# EAGLE design vis-analog-out (EAGLE 9.6.2)

## Sheet 1 of 2
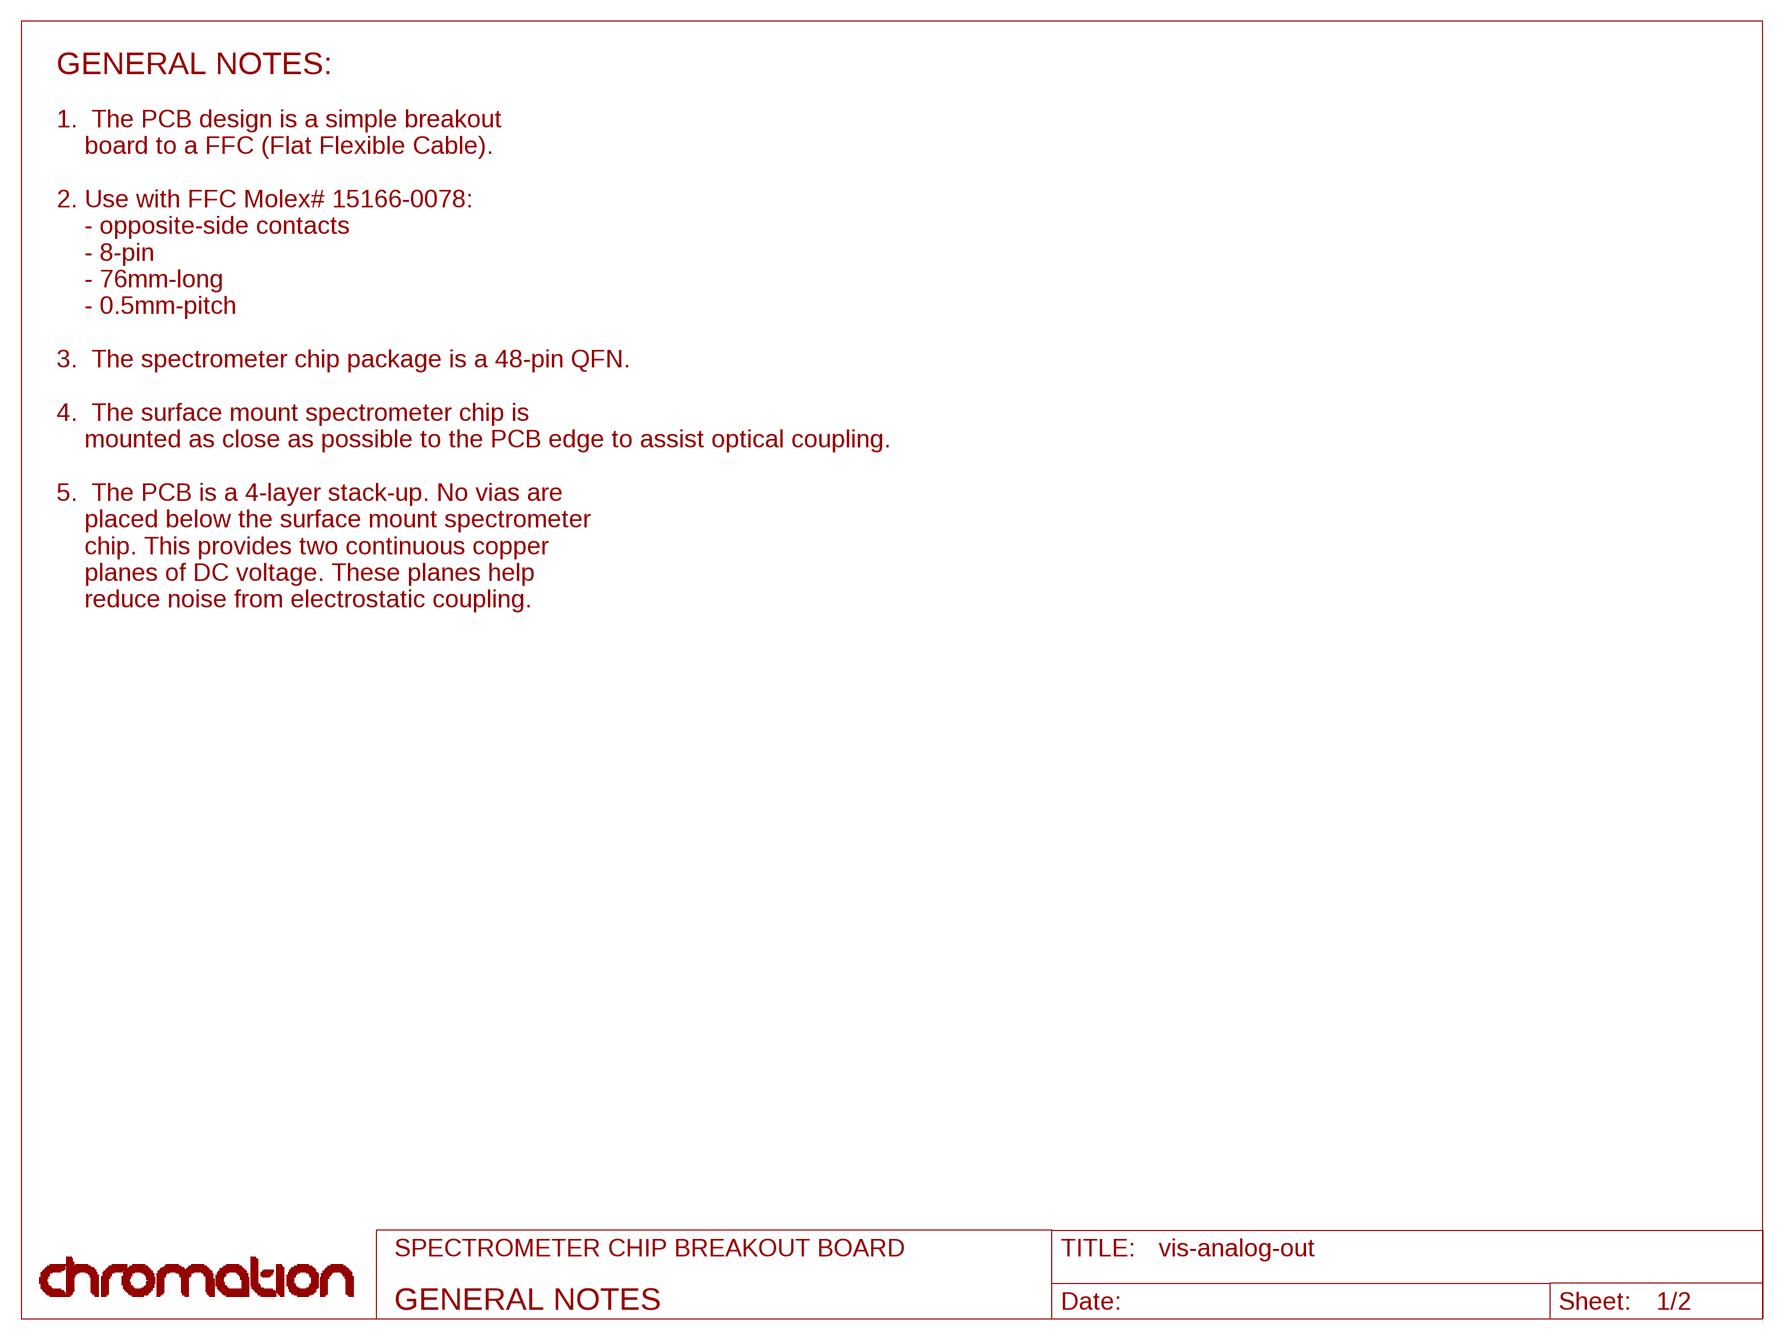
[diagram p0: schematic, sheet 1]

### Notes on the sheet
- GENERAL NOTES:
- 1.  The PCB design is a simple breakout
      board to a FFC (Flat Flexible Cable).
  
  2. Use with FFC Molex# 15166-0078:
      - opposite-side contacts
      - 8-pin
      - 76mm-long
      - 0.5mm-pitch
  
  3.  The spectrometer chip package is a 48-pin QFN.
  
  4.  The surface mount spectrometer chip is
      mounted as close as possible to the PCB edge to assist optical coupling.
  
  5.  The PCB is a 4-layer stack-up. No vias are
      placed below the surface mount spectrometer
      chip. This provides two continuous copper
      planes of DC voltage. These planes help
      reduce noise from electrostatic coupling.
- SPECTROMETER CHIP BREAKOUT BOARD
- GENERAL NOTES

## Sheet 2 of 2
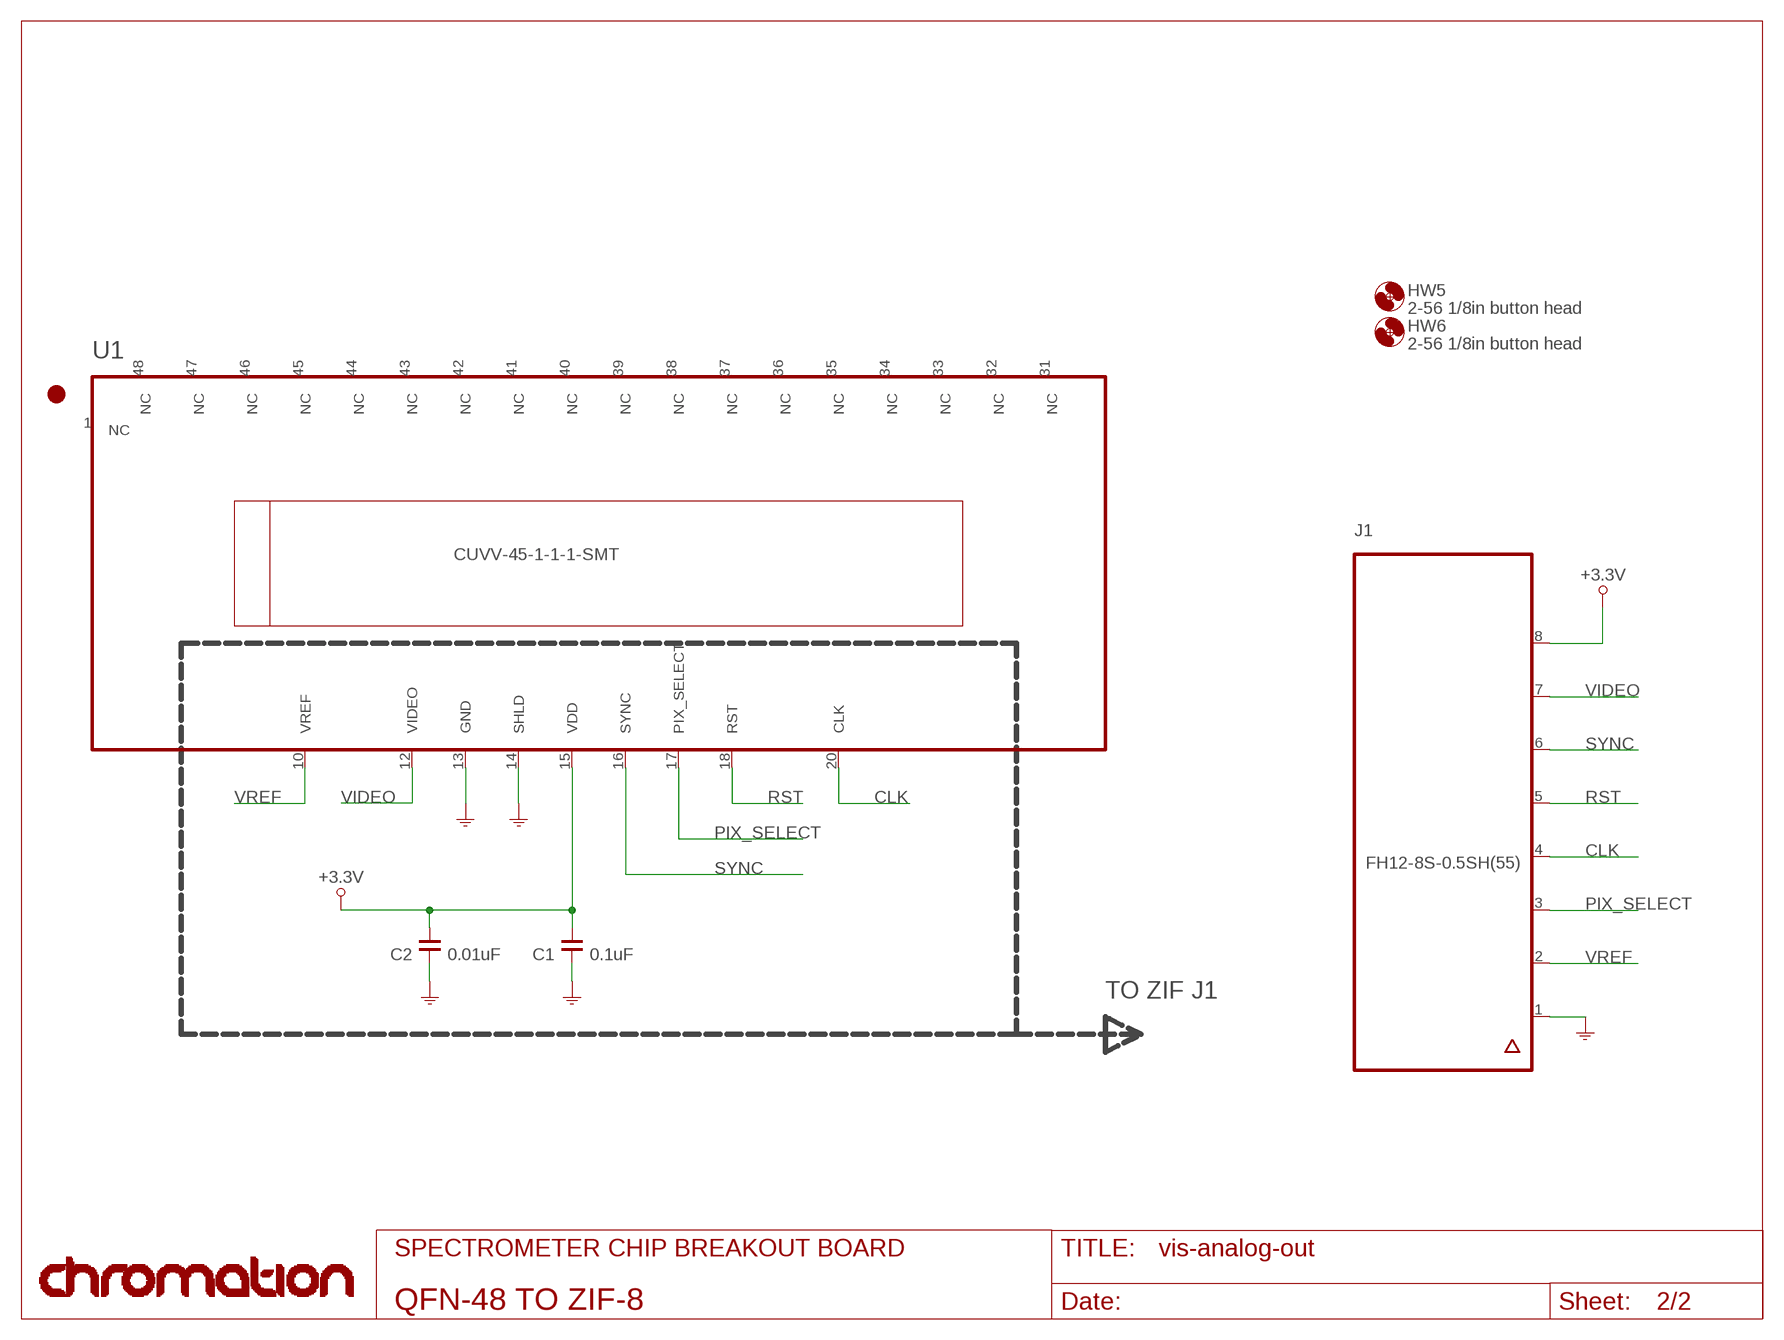
[diagram p1: schematic, sheet 2]

### Parts
C1  0.1uF  C_0603  [0603]
C2  0.01uF  C_0603  [0603]
HW5  2-56 1/8in button head  MOUNTING-HOLE_2-56_SCREW  [MCMASTER_92949A081]
HW6  2-56 1/8in button head  MOUNTING-HOLE_2-56_SCREW  [MCMASTER_92949A081]
J1  FH12-8S-0.5SH(55)  ZIF_8-PIN  [FH12-8S-0.5SH]
U1  CUVV-45-1-1-1-SMT  VIS-QFN48  [VIS-PKG]

### Nets
+3.3V: C1.1 C2.1 J1.8 U1.15(VDD)
CLK: J1.4 U1.20(CLK)
GND: C1.2 C2.2 J1.1 U1.13(GND) U1.14(SHLD)
PIX_SELECT: J1.3 U1.17(PIX_SELECT)
RST: J1.5 U1.18(RST)
SYNC: J1.6 U1.16(SYNC)
VIDEO: J1.7 U1.12(VIDEO)
VREF: J1.2 U1.10(VREF)
Unconnected: J1.LEG@1(LEG) J1.LEG@2(LEG) U1.1(NC) U1.2(NC) U1.3(NC) U1.4(NC) U1.5(NC) U1.6(NC) U1.7(NC) U1.8(NC) U1.9(NC) U1.11(NC) U1.19(NC) U1.21(NC) U1.22(NC) U1.23(NC) U1.24(NC) U1.25(NC) U1.26(NC) U1.27(NC) U1.28(NC) U1.29(NC) U1.30(NC) U1.31(NC) U1.32(NC) U1.33(NC) U1.34(NC) U1.35(NC) U1.36(NC) U1.37(NC) U1.38(NC) U1.39(NC) U1.40(NC) U1.41(NC) U1.42(NC) U1.43(NC) U1.44(NC) U1.45(NC) U1.46(NC) U1.47(NC) U1.48(NC)

### Notes on the sheet
- TO ZIF J1
- SPECTROMETER CHIP BREAKOUT BOARD
- QFN-48 TO ZIF-8

## Library data of the parts
C1 = 0603:C_; EXPORT: YES; MANUF: TDK; MANUF_PNUM: CGA3E2X7R1H104K080AA; VENDOR1: Mouser; VENDOR1_PNUM: 810-CGA3E2X7R1H104K; VENDOR1_PQ_00001: 0.10
C2 = 0603:C_; EXPORT: YES; MANUF: Kemet; MANUF_PNUM: C0603C103K5RACTU; NOTES: --; VENDOR1: Mouser; VENDOR1_PNUM: 80-C0603C103K5R; VENDOR1_PQ_00001: 0.10
HW5 HW6 = Chromation:MOUNTING-HOLE_: McMaster mounting hardware.; EXPORT: YES; MANUF: --; MANUF_PNUM: --; NOTES: 2-56 Screw, 1/8-in Long, Socket Head, Hex Drive; VENDOR1: McMaster; VENDOR1_PNUM: 92949A074; VENDOR1_PQ_00001: 0.0553
J1 = ZIF:ZIF_; EXPORT: YES; MANUF: Hirose Connector; MANUF_PNUM: FH12-8S-0.5SH(55); NOTES: --; VENDOR1: Mouser; VENDOR1_PNUM: 798-FH128S05SH55; VENDOR1_PQ_00001: 1.54
U1 = VIS-PKG:VIS; EXPORT: YES; MANUF: Chromation; MANUF_PNUM: CUVV-45-1-1-1-SMT; NOTES: --; VENDOR1: Chromation; VENDOR1_PNUM: CUVV-45-1-1-1-SMT; VENDOR1_PQ_00001: --

## Board
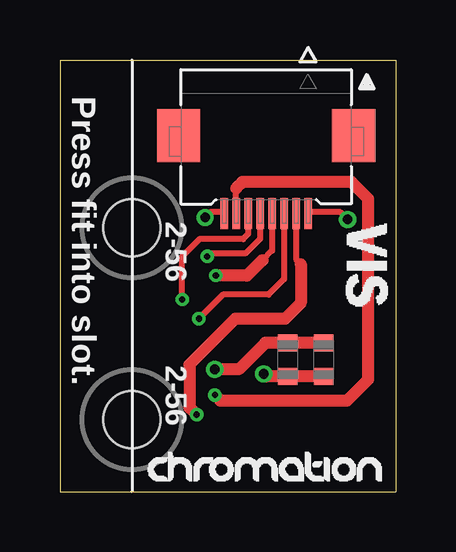
[diagram p2: board, top side]
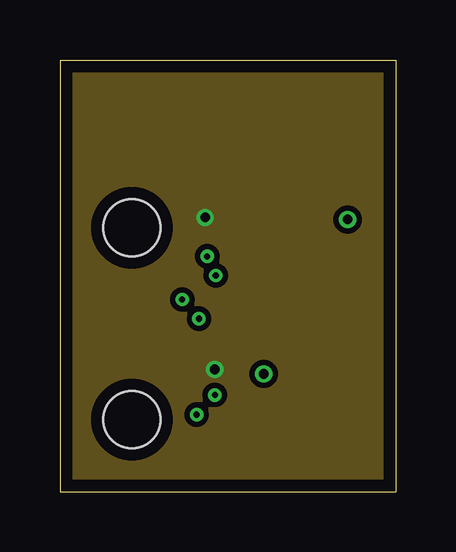
[diagram p3: board, inner layer Route2]
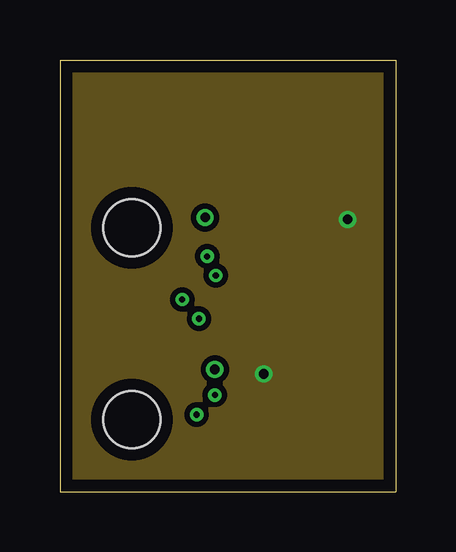
[diagram p4: board, inner layer Route15]
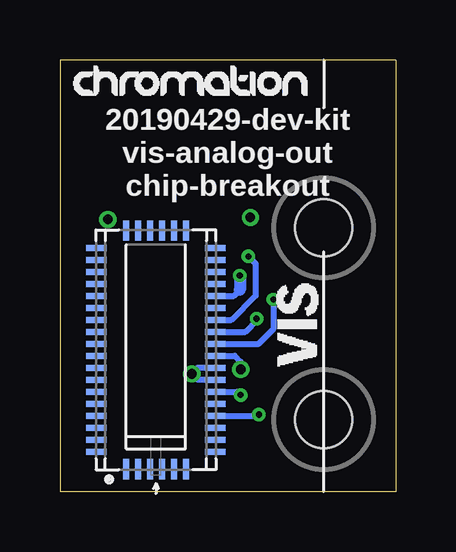
[diagram p5: board, bottom side, seen from below]

Size 14 x 18 mm. Coordinates in mm from the lower left corner, seen from the top.
Outline: 0,0 14,0 14,18 0,18 0,0
Copper layers (1*2*15*16): Top 0.035mm / dielectric 0.23mm / Route2 0.035mm / dielectric 0.93mm / Route15 0.035mm / dielectric 0.23mm / Bottom 0.035mm
Design rules "Conservative-clearance-check-before-4-layers-PCB-NG": minimum track width 5mil, minimum drill 10mil, track to track 9mil, track to pad 8mil, pad to pad 7mil, via to via 10mil, smd to smd 0mil, copper to edge 20mil, drill to drill 8mil, minimum pad ring 8mil, minimum via ring 6mil, stop-mask expansion 4mil, vias tented up to drill 100mil, thermal gap 10mil

### Footprints (pad centres in the part's own frame; a part is rotated, then mirrored left to right if it is on the bottom)
0603 = smd 0.7 x 0.8: 1 -0.7,0; 2 0.7,0
MCMASTER_92949A081 = hole 2.388: 0,0
FH12-8S-0.5SH = smd 0.3 x 1.3: 1 1.75,-3.2; 2 1.25,-3.2; 3 0.75,-3.2; 4 0.25,-3.2; 5 -0.25,-3.2; 6 -0.75,-3.2; 7 -1.25,-3.2; 8 -1.75,-3.2 | smd 1.8 x 2.2: LEG@1 -3.65,0.05; LEG@2 3.65,0.05
VIS-PKG = smd 0.25 x 0.85: 1 -1.25,-4.975; 2 -0.75,-4.975; 3 -0.25,-4.975; 4 0.25,-4.975; 5 0.75,-4.975; 6 1.25,-4.975; 25 1.25,4.975; 26 0.75,4.975; 27 0.25,4.975; 28 -0.25,4.975; 29 -0.75,4.975; 30 -1.25,4.975 | smd 0.85 x 0.25: 7 2.475,-4.25; 8 2.475,-3.75; 9 2.475,-3.25; 10 2.475,-2.75; 11 2.475,-2.25; 12 2.475,-1.75; 13 2.475,-1.25; 14 2.475,-0.75; 15 2.475,-0.25; 16 2.475,0.25; 17 2.475,0.75; 18 2.475,1.25; 19 2.475,1.75; 20 2.475,2.25; 21 2.475,2.75; 22 2.475,3.25; 23 2.475,3.75; 24 2.475,4.25; 31 -2.475,4.25; 32 -2.475,3.75; 33 -2.475,3.25; 34 -2.475,2.75; 35 -2.475,2.25; 36 -2.475,1.75; 37 -2.475,1.25; 38 -2.475,0.75; 39 -2.475,0.25; 40 -2.475,-0.25; 41 -2.475,-0.75; 42 -2.475,-1.25; 43 -2.475,-1.75; 44 -2.475,-2.25; 45 -2.475,-2.75; 46 -2.475,-3.25; 47 -2.475,-3.75; 48 -2.475,-4.25

### Placement (x,y rotation side)
C1  9.5,5.5 270 top
C2  11,5.5 270 top
HW5  3,11 0 bottom
HW6  3,3 0 bottom
J1  8.6,14.8 0 top
U1  10,5.91 0 bottom

### Tracks (layer width: path | path; a pad name or v marks a point on that pad's centre or on a via)
+3.3V  (via drill 0.41)
  Top 0.254: v6.06,11.44 6.06,11.46 6.25,11.65 6.82,11.65 6.85,11.62 J1.8
  Top 0.508: C2.1 C1.1 8.57,6.2 7.46,5.09 v6.46,5.09
  Bottom 0.254: U1.15 6.71,5.66 6.46,5.41 v6.46,5.09
  pour Route2: 0,0 0,18 14,18 14,0
CLK  (via drill 0.25)
  Top 0.254: J1.4 8.85,10.04 8.45,9.64
  Top 0.508: 8.45,9.64 8.43,9.64 7.8,9.01 v6.5,9.01
  Bottom 0.254: U1.20 6.75,8.16 6.5,8.41
  Bottom 0.508: v6.5,9.01 6.5,8.41
GND  (via drill 0.41)
  Top 0.254: J1.1 10.35,11.62 10.38,11.65 11.7,11.65 v12,11.35
  Top 0.508: C2.2 C1.2 8.61,4.8 v8.5,4.91
  Bottom 0.254: U1.13 8.25,4.66 v8.5,4.91 8.25,5.16 U1.14
  pour Route15: 0,0 0,18 14,18 14,0
PIX_SELECT  (via drill 0.25)
  Top 0.254: J1.3 9.35,8.86 8.7,8.21 6.8,8.21 v5.8,7.21
  Bottom 0.254: U1.17 6.27,6.66 5.76,7.17 v5.8,7.21
RST  (via drill 0.25)
  Top 0.254: v6.14,9.81 6.26,9.93 7.74,9.93 8.35,10.54 8.35,11.62 J1.5
  Bottom 0.254: U1.18 6.85,7.16 5.84,8.17 5.84,9.51 v6.14,9.81
SYNC  (via drill 0.25)
  Top 0.254: v5.1,8.01 5.1,9.81 5.82,10.53 7.64,10.53 7.85,10.74 7.85,11.62 J1.6
  Bottom 0.254: U1.16 5.72,6.16 5.1,6.78 v5.1,8.01
VIDEO  (via drill 0.25)
  Top 0.254: J1.7 7.35,12.65
  Top 0.508: 7.35,12.65 7.61,12.91 12.16,12.91 12.86,12.21 12.86,4.67 11.99,3.79 6.7,3.79 v6.46,4.03
  Bottom 0.254: U1.12 6.61,4.16 6.48,4.03 v6.46,4.03
VREF  (via drill 0.25)
  Top 0.254: 10.05,9.48 9.85,9.68 J1.2
  Top 0.508: v5.7,3.21 5.4,3.51 5.4,5.3 7.31,7.21 9.4,7.21 10.05,7.86 10.05,9.48
  Bottom 0.254: U1.10 5.75,3.16 v5.7,3.21

### Text on the board
tPlace: Press fit into slot. | 2-56 | 2-56
bPlace: 20190429-dev-kit / vis-analog-out / chip-breakout